# EAGLE design UltiMem64_v1 (EAGLE 7.7.0)

## Sheet 1 of 2
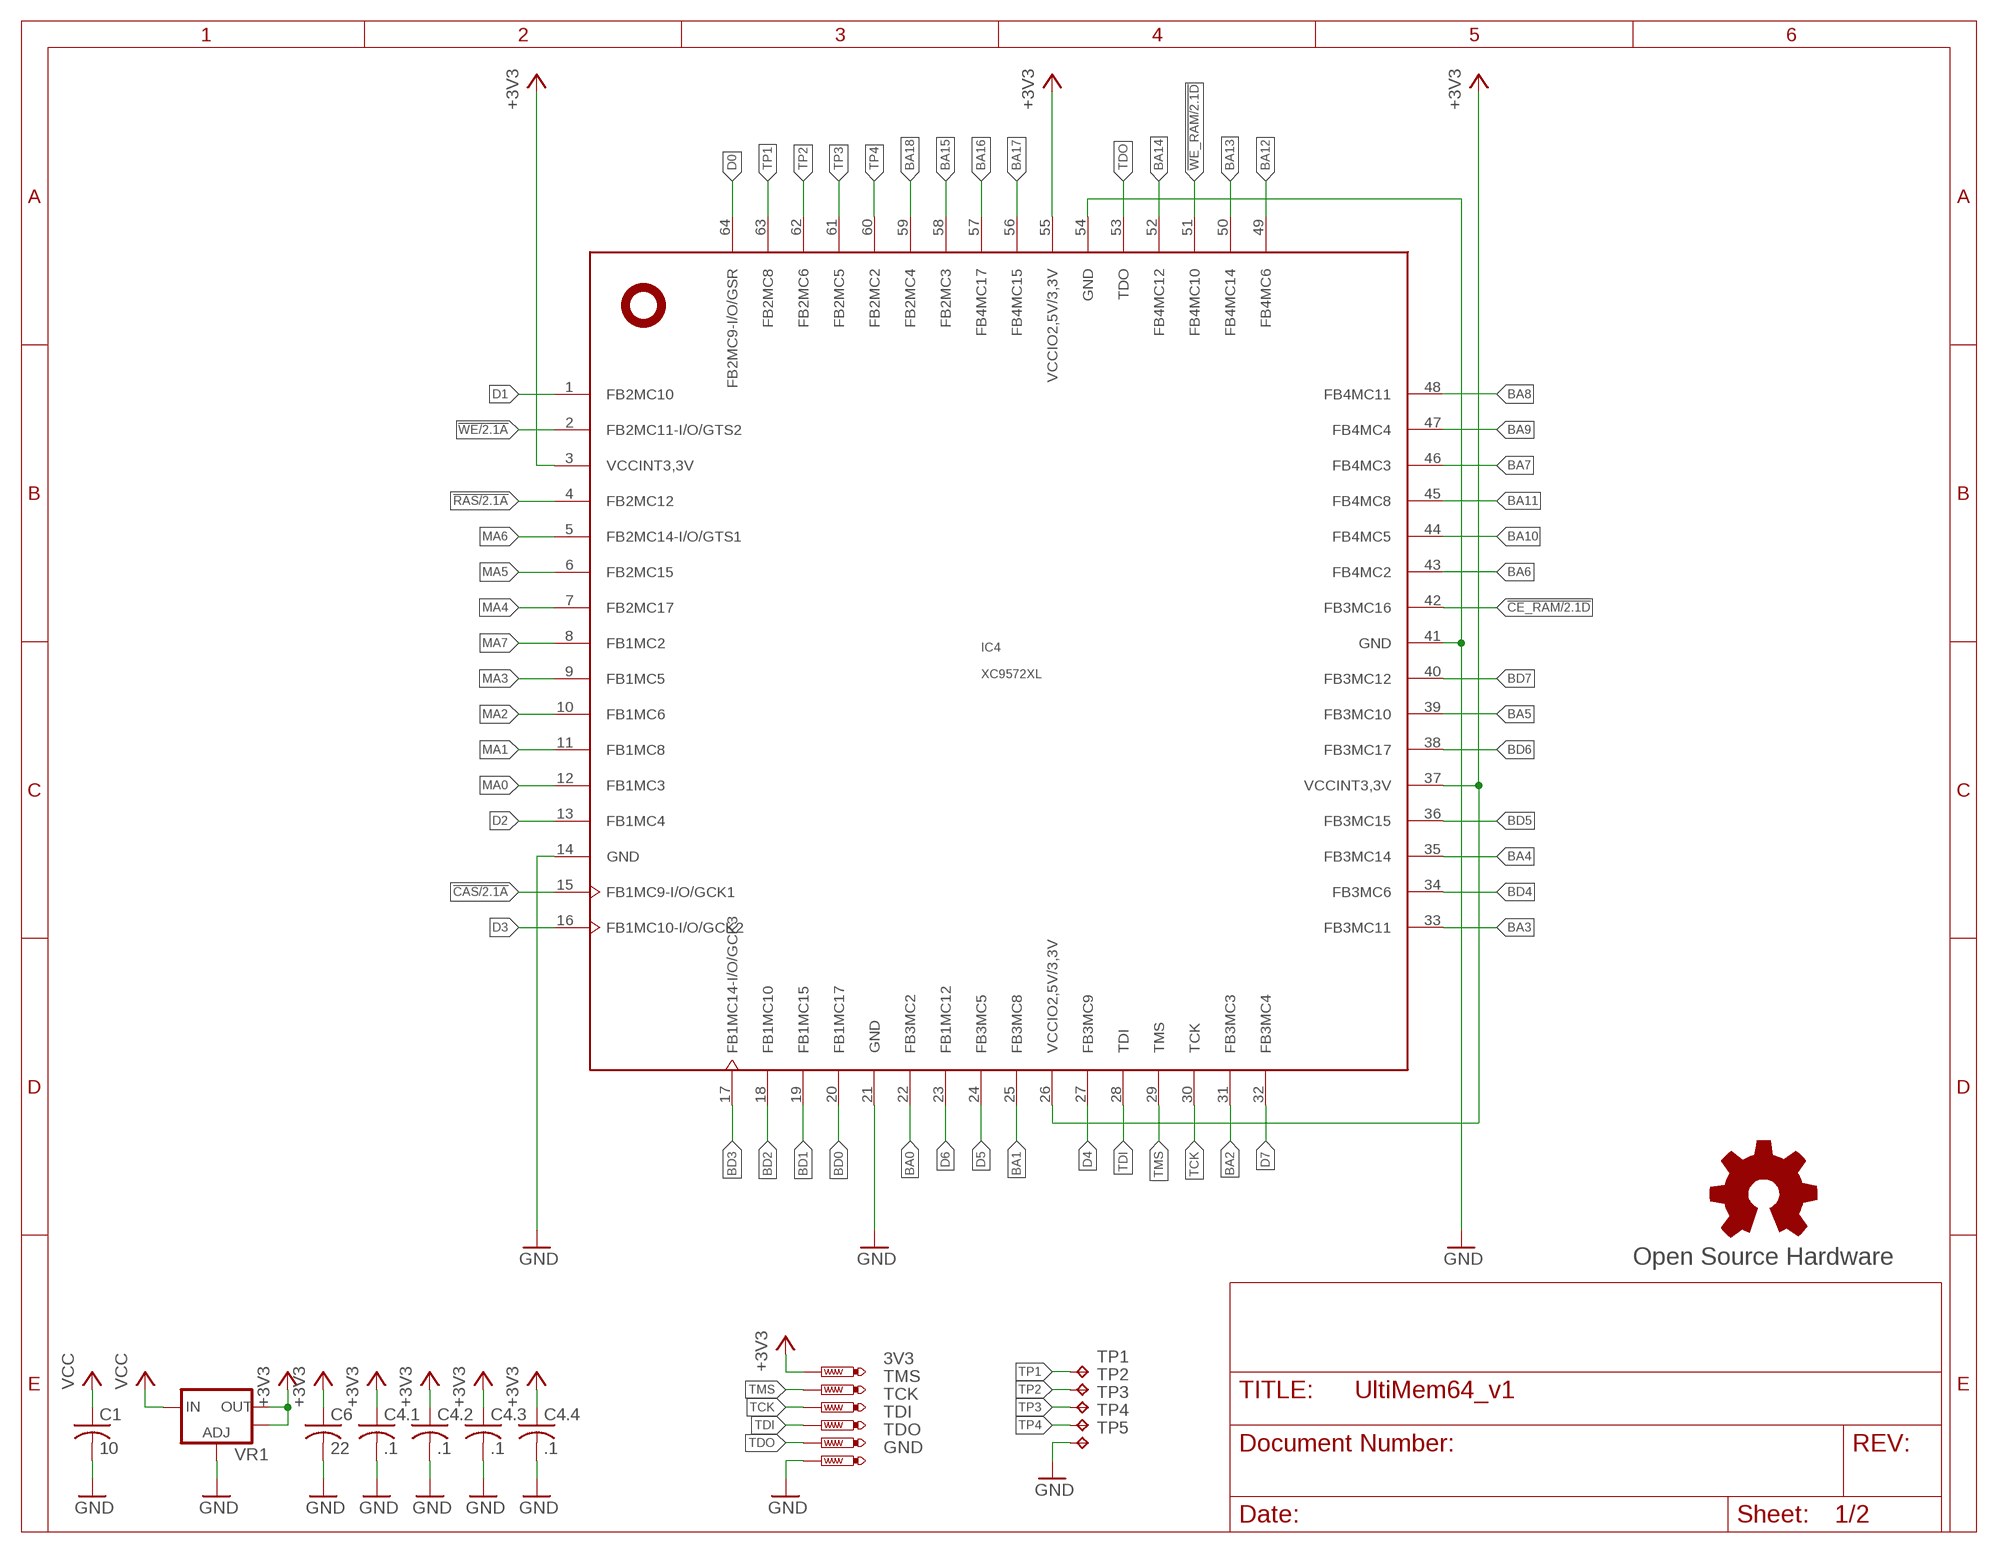
[diagram p0: schematic, sheet 1]

### Parts
3V3  PTR1TP08R  [TP08R]
C1  10  C-USC0805  [C0805]
C4.1  .1  C-USC0402  [C0402]
C4.2  .1  C-USC0402  [C0402]
C4.3  .1  C-USC0402  [C0402]
C4.4  .1  C-USC0402  [C0402]
C6  22  C-USC0805  [C0805]
GND  PTR1TP08R  [TP08R]
GOLD_ORB_SM1  Open Source Hardware  OSHWLOGOLOGO5MM  [OSHW_5MM]
IC4  XC9572XL  XC9572XLVQG64  [VQFP64]
TCK  PTR1TP08R  [TP08R]
TDI  PTR1TP08R  [TP08R]
TDO  PTR1TP08R  [TP08R]
TMS  PTR1TP08R  [TP08R]
TP1  TPPAD1-13  [P1-13]
TP2  TPPAD1-13  [P1-13]
TP3  TPPAD1-13  [P1-13]
TP4  TPPAD1-13  [P1-13]
TP5  TPPAD1-13  [P1-13]
VR1  V_REG_LM1117SOT223  [SOT223]

### Nets
!CAS: IC4.15(FB1MC9-I/O/GCK1) ; also sheet 2
!CE_RAM: IC4.42(FB3MC16) ; also sheet 2
!RAS: IC4.4(FB2MC12) ; also sheet 2
!WE: IC4.2(FB2MC11-I/O/GTS2) ; also sheet 2
!WE_RAM: IC4.51(FB4MC10) ; also sheet 2
+3V3: 3V3.TP C4.1.1 C4.2.1 C4.3.1 C4.4.1 C6.1 IC4.3(VCCINT3,3V) IC4.26(VCCIO2,5V/3,3V) IC4.37(VCCINT3,3V) IC4.55(VCCIO2,5V/3,3V) VR1.2(OUT) VR1.4(OUT)
BA0: IC4.22(FB3MC2) ; also sheet 2
BA1: IC4.25(FB3MC8) ; also sheet 2
BA2: IC4.31(FB3MC3) ; also sheet 2
BA3: IC4.33(FB3MC11) ; also sheet 2
BA4: IC4.35(FB3MC14) ; also sheet 2
BA5: IC4.39(FB3MC10) ; also sheet 2
BA6: IC4.43(FB4MC2) ; also sheet 2
BA7: IC4.46(FB4MC3) ; also sheet 2
BA8: IC4.48(FB4MC11) ; also sheet 2
BA9: IC4.47(FB4MC4) ; also sheet 2
BA10: IC4.44(FB4MC5) ; also sheet 2
BA11: IC4.45(FB4MC8) ; also sheet 2
BA12: IC4.49(FB4MC6) ; also sheet 2
BA13: IC4.50(FB4MC14) ; also sheet 2
BA14: IC4.52(FB4MC12) ; also sheet 2
BA15: IC4.58(FB2MC3) ; also sheet 2
BA16: IC4.57(FB4MC17) ; also sheet 2
BA17: IC4.56(FB4MC15) ; also sheet 2
BA18: IC4.59(FB2MC4) ; also sheet 2
BD0: IC4.20(FB1MC17) ; also sheet 2
BD1: IC4.19(FB1MC15) ; also sheet 2
BD2: IC4.18(FB1MC10) ; also sheet 2
BD3: IC4.17(FB1MC14-I/O/GCK3) ; also sheet 2
BD4: IC4.34(FB3MC6) ; also sheet 2
BD5: IC4.36(FB3MC15) ; also sheet 2
BD6: IC4.38(FB3MC17) ; also sheet 2
BD7: IC4.40(FB3MC12) ; also sheet 2
D0: IC4.64(FB2MC9-I/O/GSR) ; also sheet 2
D1: IC4.1(FB2MC10) ; also sheet 2
D2: IC4.13(FB1MC4) ; also sheet 2
D3: IC4.16(FB1MC10-I/O/GCK2) ; also sheet 2
D4: IC4.27(FB3MC9) ; also sheet 2
D5: IC4.24(FB3MC5) ; also sheet 2
D6: IC4.23(FB1MC12) ; also sheet 2
D7: IC4.32(FB3MC4) ; also sheet 2
GND: C1.2 C4.1.2 C4.2.2 C4.3.2 C4.4.2 C6.2 GND.TP IC4.14(GND) IC4.21(GND) IC4.41(GND) IC4.54(GND) TP5.TP VR1.1(ADJ) ; also sheet 2
MA0: IC4.12(FB1MC3) ; also sheet 2
MA1: IC4.11(FB1MC8) ; also sheet 2
MA2: IC4.10(FB1MC6) ; also sheet 2
MA3: IC4.9(FB1MC5) ; also sheet 2
MA4: IC4.7(FB2MC17) ; also sheet 2
MA5: IC4.6(FB2MC15) ; also sheet 2
MA6: IC4.5(FB2MC14-I/O/GTS1) ; also sheet 2
MA7: IC4.8(FB1MC2) ; also sheet 2
TCK: IC4.30(TCK) TCK.TP
TDI: IC4.28(TDI) TDI.TP
TDO: IC4.53(TDO) TDO.TP
TMS: IC4.29(TMS) TMS.TP
TP1: IC4.63(FB2MC8) TP1.TP
TP2: IC4.62(FB2MC6) TP2.TP
TP3: IC4.61(FB2MC5) TP3.TP
TP4: IC4.60(FB2MC2) TP4.TP
VCC: C1.1 VR1.3(IN) ; also sheet 2

## Sheet 2 of 2: MEMORY
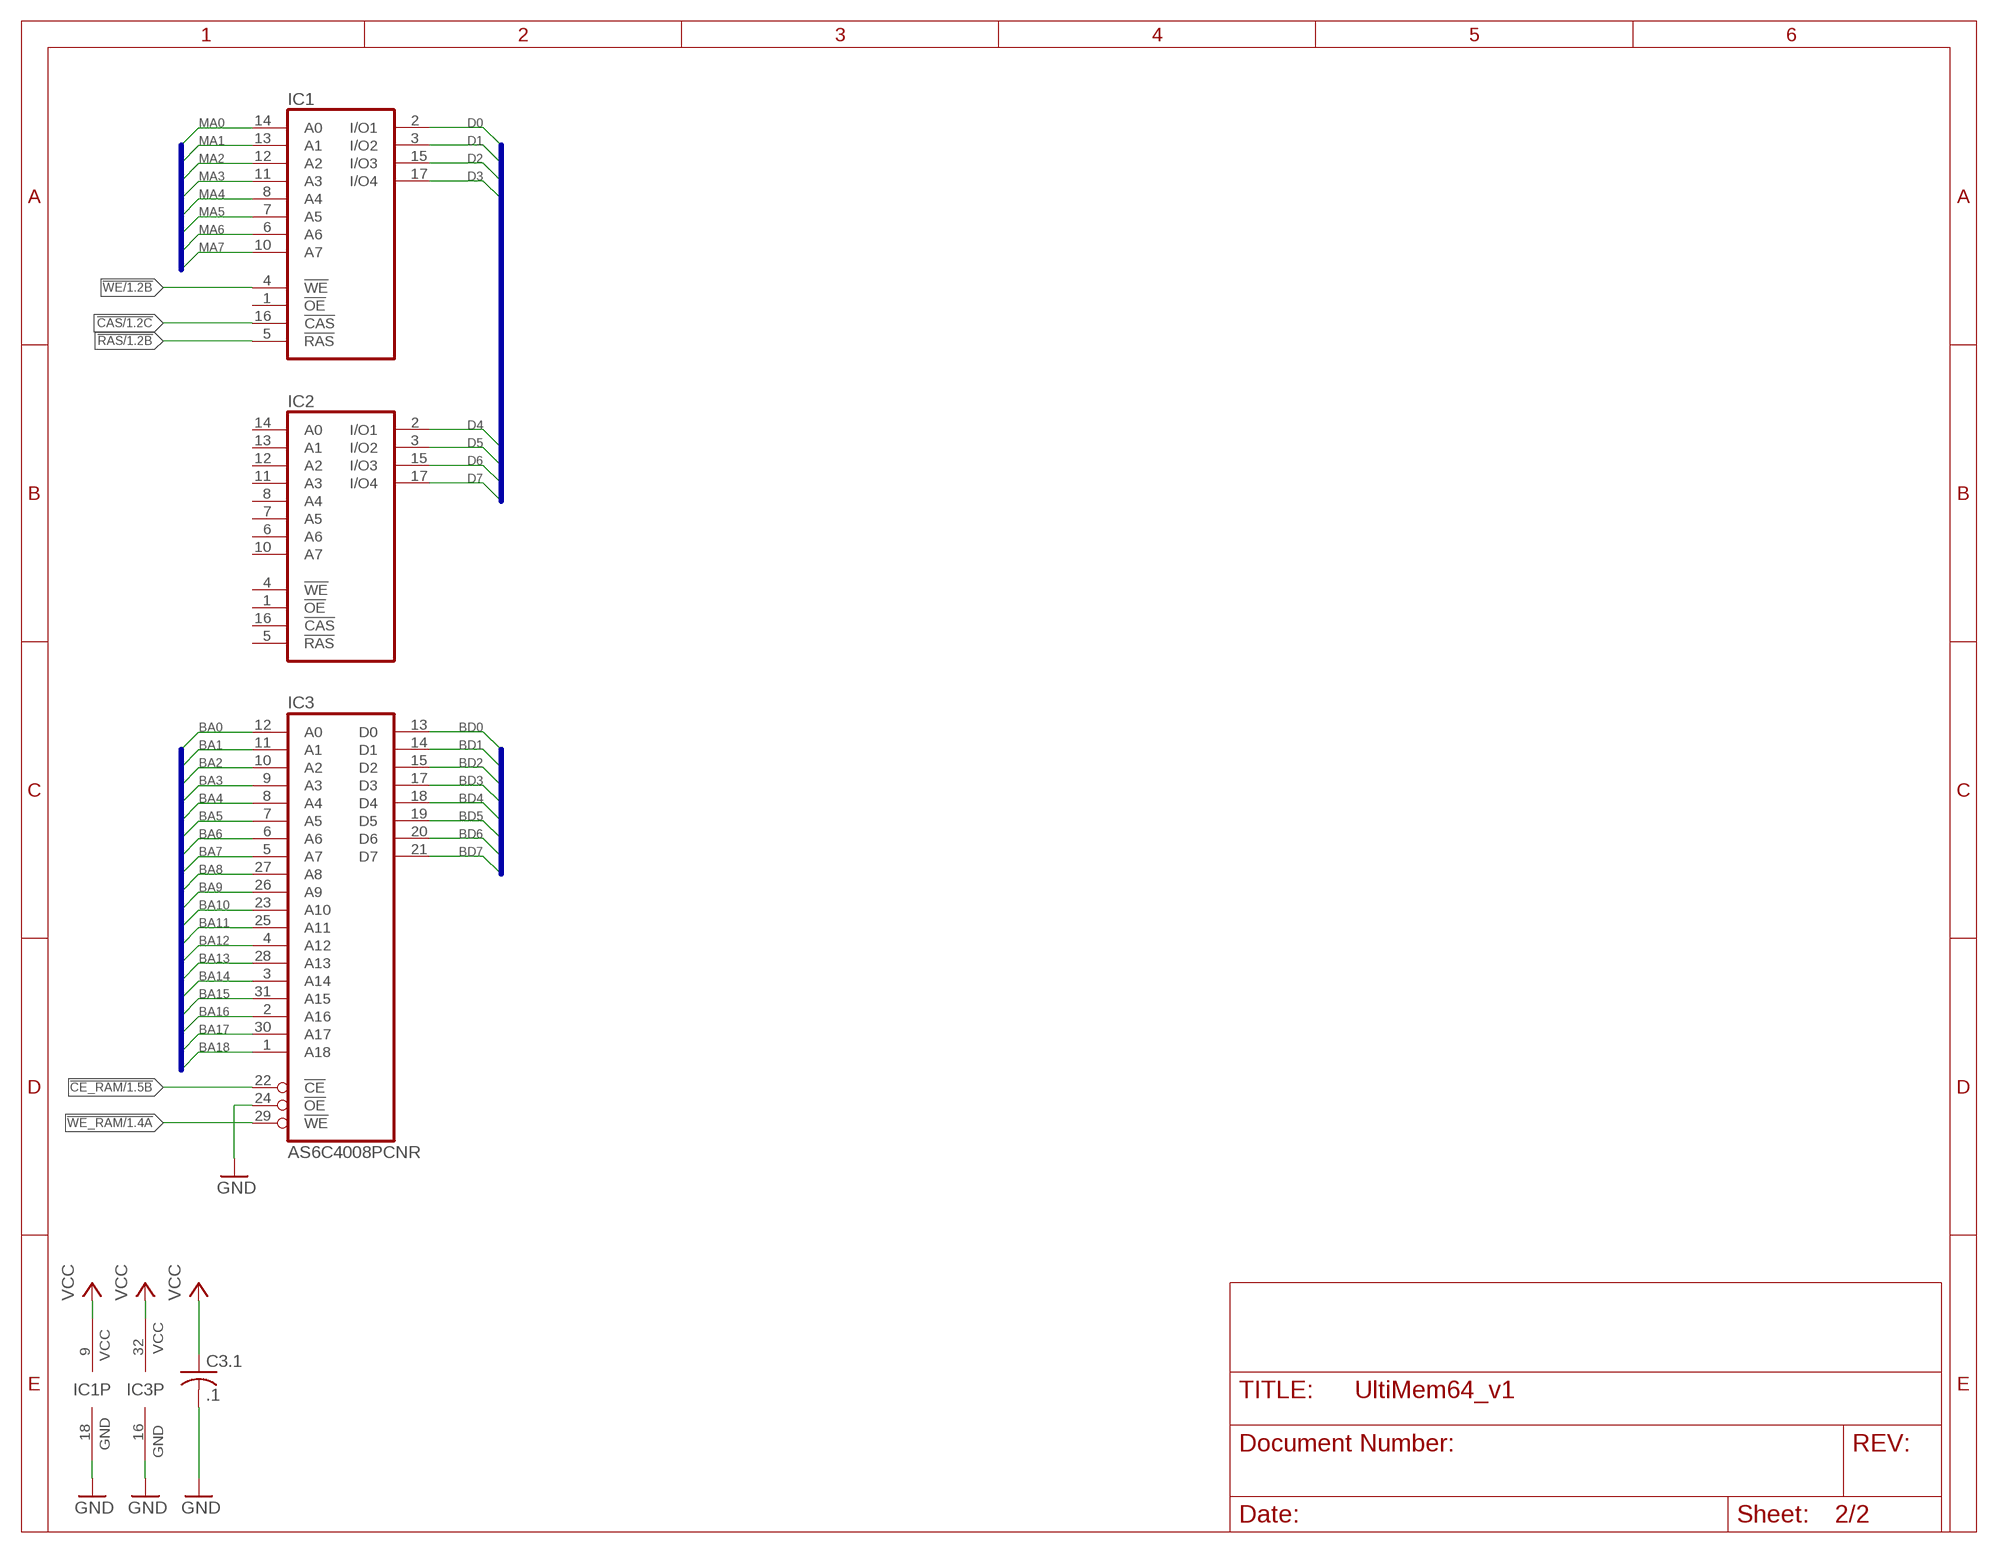
[diagram p1: schematic, sheet 2]

### Parts
C3.1  .1  C-USC0402  [C0402]
IC1  41464C-HDR  [DIL18_REV]
IC2  41464C-HDR  [DIL18_REV]
IC3  AS6C4008PCNR  [DIL32-RP]

### Nets
!CAS: IC1.16(!CAS) ; also sheet 1
!CE_RAM: IC3.22(!CE) ; also sheet 1
!RAS: IC1.5(!RAS) ; also sheet 1
!WE: IC1.4(!WE) ; also sheet 1
!WE_RAM: IC3.29(!WE) ; also sheet 1
BA0: IC3.12(A0) ; also sheet 1
BA1: IC3.11(A1) ; also sheet 1
BA2: IC3.10(A2) ; also sheet 1
BA3: IC3.9(A3) ; also sheet 1
BA4: IC3.8(A4) ; also sheet 1
BA5: IC3.7(A5) ; also sheet 1
BA6: IC3.6(A6) ; also sheet 1
BA7: IC3.5(A7) ; also sheet 1
BA8: IC3.27(A8) ; also sheet 1
BA9: IC3.26(A9) ; also sheet 1
BA10: IC3.23(A10) ; also sheet 1
BA11: IC3.25(A11) ; also sheet 1
BA12: IC3.4(A12) ; also sheet 1
BA13: IC3.28(A13) ; also sheet 1
BA14: IC3.3(A14) ; also sheet 1
BA15: IC3.31(A15) ; also sheet 1
BA16: IC3.2(A16) ; also sheet 1
BA17: IC3.30(A17) ; also sheet 1
BA18: IC3.1(A18) ; also sheet 1
BD0: IC3.13(D0) ; also sheet 1
BD1: IC3.14(D1) ; also sheet 1
BD2: IC3.15(D2) ; also sheet 1
BD3: IC3.17(D3) ; also sheet 1
BD4: IC3.18(D4) ; also sheet 1
BD5: IC3.19(D5) ; also sheet 1
BD6: IC3.20(D6) ; also sheet 1
BD7: IC3.21(D7) ; also sheet 1
D0: IC1.2(I/O1) ; also sheet 1
D1: IC1.3(I/O2) ; also sheet 1
D2: IC1.15(I/O3) ; also sheet 1
D3: IC1.17(I/O4) ; also sheet 1
D4: IC2.2(I/O1) ; also sheet 1
D5: IC2.3(I/O2) ; also sheet 1
D6: IC2.15(I/O3) ; also sheet 1
D7: IC2.17(I/O4) ; also sheet 1
GND: C3.1.2 IC1.18(GND) IC3.16(GND) IC3.24(!OE) ; also sheet 1
MA0: IC1.14(A0) ; also sheet 1
MA1: IC1.13(A1) ; also sheet 1
MA2: IC1.12(A2) ; also sheet 1
MA3: IC1.11(A3) ; also sheet 1
MA4: IC1.8(A4) ; also sheet 1
MA5: IC1.7(A5) ; also sheet 1
MA6: IC1.6(A6) ; also sheet 1
MA7: IC1.10(A7) ; also sheet 1
VCC: C3.1.1 IC1.9(VCC) IC3.32(VCC) ; also sheet 1
Unconnected: IC1.1(!OE) IC2.1(!OE) IC2.4(!WE) IC2.5(!RAS) IC2.6(A6) IC2.7(A5) IC2.8(A4) IC2.10(A7) IC2.11(A3) IC2.12(A2) IC2.13(A1) IC2.14(A0) IC2.16(!CAS)

### Buses
MA[0..7]
D[0..7]
BD[0..7]
BA[0..18]

## Power pins joined to a net without a drawn wire
GND: IC2.18(GND)
VCC: IC2.9(VCC)

## Library data of the parts
3V3 GND TCK TDI TDO TMS = testpad:PTR1: TEST PIN
C1 C3.1 C4.1-C4.4 C6 = rcl:C-US: CAPACITOR, American symbol
GOLD_ORB_SM1 = oshw:OSHWLOGO: The OSHW logo for PCB layout
IC1 IC2 = memory-jlb:41464C: MEMORY
IC3 = memory-alliance:AS6C4008
IC4 = xilinx_xc95XXXxl:XC9572XLVQG64
TP1-TP5 = testpad:TP: Test pad
VR1 = SparkFun:V_REG_LM1117: Voltage Regulator LM1117 Standard adjustable voltage regulator but in SMD form. Spark Fun Electronics SKU : COM-00595

## Board
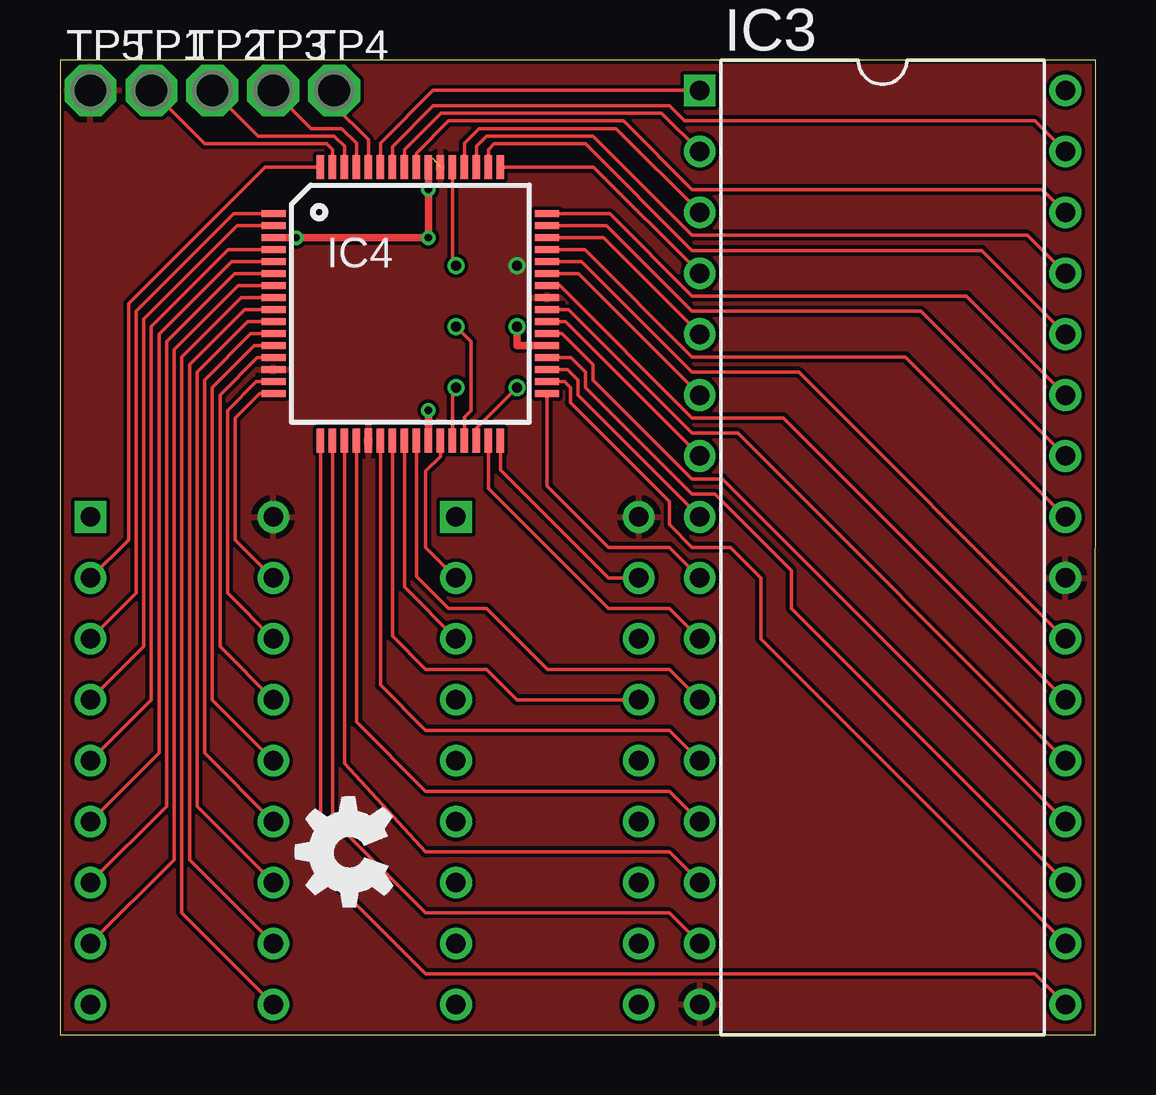
[diagram p2: board, top side]
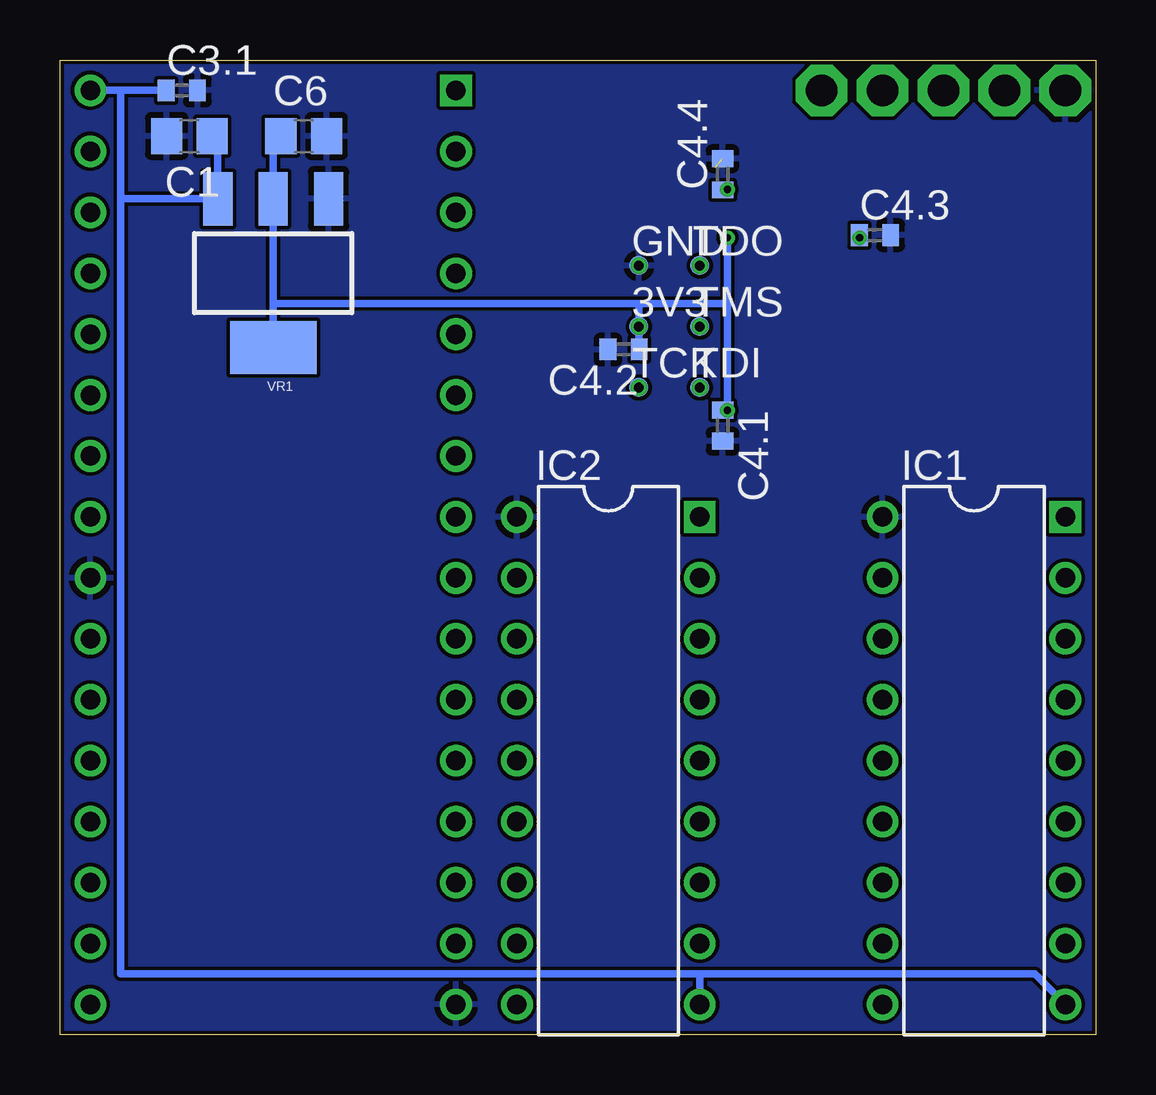
[diagram p3: board, bottom side, seen from below]

Size 43.18 x 40.64 mm. Coordinates in mm from the lower left corner, seen from the top.
Outline: 0,0 43.16,0 43.18,40.64 0,40.64 0,0
Copper layers (1*16): Top 0.035mm / dielectric 1.5mm / Bottom 0.035mm
Design rules "hackvana": minimum track width 6mil, minimum drill 0.3mm, track to track 6mil, track to pad 6mil, pad to pad 6mil, via to via 6mil, smd to smd 0mil, copper to edge 6mil, drill to drill 6mil, minimum pad ring 10mil, minimum via ring 6mil, stop-mask expansion 2mil, vias tented up to drill 100mil, thermal gap 10mil

### Footprints (pad centres in the part's own frame; a part is rotated, then mirrored left to right if it is on the bottom)
TP08R = smd 0.8 x 0.8: TP 0,0
C0805 = smd 1.3 x 1.5: 1 -0.95,0; 2 0.95,0
C0402 = smd 0.7 x 0.9: 1 -0.65,0; 2 0.65,0
DIL18_REV = drill 0.813 square: 1 -10.16,-3.81 | drill 0.813: 2 -7.62,-3.81; 3 -5.08,-3.81; 4 -2.54,-3.81; 5 0,-3.81; 6 2.54,-3.81; 7 5.08,-3.81; 8 7.62,-3.81; 9 10.16,-3.81; 10 10.16,3.81; 11 7.62,3.81; 12 5.08,3.81; 13 2.54,3.81; 14 0,3.81; 15 -2.54,3.81; 16 -5.08,3.81; 17 -7.62,3.81; 18 -10.16,3.81
DIL32-RP = drill 0.813 square: 1 -19.05,-7.62 | drill 0.813: 2 -16.51,-7.62; 3 -13.97,-7.62; 4 -11.43,-7.62; 5 -8.89,-7.62; 6 -6.35,-7.62; 7 -3.81,-7.62; 8 -1.27,-7.62; 9 1.27,-7.62; 10 3.81,-7.62; 11 6.35,-7.62; 12 8.89,-7.62; 13 11.43,-7.62; 14 13.97,-7.62; 15 16.51,-7.62; 16 19.05,-7.62; 17 19.05,7.62; 18 16.51,7.62; 19 13.97,7.62; 20 11.43,7.62; 21 8.89,7.62; 22 6.35,7.62; 23 3.81,7.62; 24 1.27,7.62; 25 -1.27,7.62; 26 -3.81,7.62; 27 -6.35,7.62; 28 -8.89,7.62; 29 -11.43,7.62; 30 -13.97,7.62; 31 -16.51,7.62; 32 -19.05,7.62
VQFP64 = smd 1 x 0.3: 1 -5.7,3.75; 2 -5.7,3.25; 3 -5.7,2.75; 4 -5.7,2.25; 5 -5.7,1.75; 6 -5.7,1.25; 7 -5.7,0.75; 8 -5.7,0.25; 9 -5.7,-0.25; 10 -5.7,-0.75; 11 -5.7,-1.25; 12 -5.7,-1.75; 13 -5.7,-2.25; 14 -5.7,-2.75; 15 -5.7,-3.25; 16 -5.7,-3.75; 33 5.7,-3.75; 34 5.7,-3.25; 35 5.7,-2.75; 36 5.7,-2.25; 37 5.7,-1.75; 38 5.7,-1.25; 39 5.7,-0.75; 40 5.7,-0.25; 41 5.7,0.25; 42 5.7,0.75; 43 5.7,1.25; 44 5.7,1.75; 45 5.7,2.25; 46 5.7,2.75; 47 5.7,3.25; 48 5.7,3.75 | smd 0.3 x 1: 17 -3.75,-5.7; 18 -3.25,-5.7; 19 -2.75,-5.7; 20 -2.25,-5.7; 21 -1.75,-5.7; 22 -1.25,-5.7; 23 -0.75,-5.7; 24 -0.25,-5.7; 25 0.25,-5.7; 26 0.75,-5.7; 27 1.25,-5.7; 28 1.75,-5.7; 29 2.25,-5.7; 30 2.75,-5.7; 31 3.25,-5.7; 32 3.75,-5.7; 49 3.75,5.7; 50 3.25,5.7; 51 2.75,5.7; 52 2.25,5.7; 53 1.75,5.7; 54 1.25,5.7; 55 0.75,5.7; 56 0.25,5.7; 57 -0.25,5.7; 58 -0.75,5.7; 59 -1.25,5.7; 60 -1.75,5.7; 61 -2.25,5.7; 62 -2.75,5.7; 63 -3.25,5.7; 64 -3.75,5.7
P1-13 = drill 1.321 pad 2.159 octagon: TP 0,0
SOT223 = smd 1.219 x 2.235: 1 -2.311,-3.099; 2 0,-3.099; 3 2.311,-3.099 | smd 3.6 x 2.2: 4 0,3.099

### Placement (x,y rotation side)
3V3  19.05,29.53 0 bottom
C1  37.78,37.47 180 bottom
C3.1  38.1,39.37 0 bottom
C4.1  15.56,25.4 270 bottom
C4.2  19.68,28.57 180 bottom
C4.3  9.21,33.34 0 bottom
C4.4  15.56,35.88 90 bottom
C6  33.02,37.47 0 bottom
GND  19.05,32.07 0 bottom
GOLD_ORB_SM1  12.06,7.62 90 top
IC1  5.08,11.43 270 top
IC2  20.32,11.43 270 top
IC3  34.29,20.32 270 top
IC4  14.61,30.48 0 top
TCK  19.05,26.99 0 bottom
TDI  16.51,26.99 0 bottom
TDO  16.51,32.07 0 bottom
TMS  16.51,29.53 0 bottom
TP1  3.81,39.37 0 top
TP2  6.35,39.37 0 top
TP3  8.89,39.37 0 top
TP4  11.43,39.37 0 top
TP5  1.27,39.37 0 top
VR1  34.29,31.75 180 bottom

### Tracks (layer width: path | path; a pad name or v marks a point on that pad's centre or on a via)
!CAS
  Top 0.152: IC1.16 6.99,18.41 6.99,26.04 8.18,27.23 IC4.15
!CE_RAM
  Top 0.152: IC3.22 30.16,25.72 26.35,25.72 20.84,31.23 IC4.42
!RAS
  Top 0.152: IC1.5 3.81,13.97 3.81,29.53 7.01,32.73 IC4.4
!WE
  Top 0.152: IC1.4 3.49,16.19 3.49,29.84 7.38,33.73 IC4.2
!WE_RAM
  Top 0.152: IC3.29 40.32,33.34 26.35,33.34 22.23,37.47 17.78,37.47 17.36,37.04 IC4.51
+3V3  (via drill 0.3, 0.41)
  Top 0.305: IC4.55 v15.36,35.24 v15.36,33.23 v9.84,33.23 IC4.3 | IC4.37 19.05,28.73 3V3.TP | v15.36,26.04 IC4.26
  Bottom 0.305: v15.36,33.23 15.36,30.48 | 15.36,30.48 v15.36,26.04 15.54,26.04 C4.1.1 | 34.29,30.48 VR1.2 34.29,37.47 C6.1 | 34.29,30.48 19.05,30.48 | 19.05,30.48 15.36,30.48 | VR1.4 34.29,30.48 | C4.4.1 15.36,35.23 v15.36,35.24 | C4.3.1 9.84,33.32 v9.84,33.23 | C4.2.1 19.05,28.59 3V3.TP 19.05,30.48
  other vias: 19.05,29.53
BA0
  Top 0.152: IC3.12 25.4,12.7 15.24,12.7 13.36,14.59 IC4.22
BA1
  Top 0.152: IC3.11 25.4,15.24 20.32,15.24 17.78,17.78 16.19,17.78 14.86,19.12 IC4.25
BA2
  Top 0.152: IC3.10 25.4,17.78 22.86,17.78 17.86,22.79 IC4.31
BA3
  Top 0.152: IC3.9 25.4,20.32 22.86,20.32 20.3,22.88 IC4.33
BA4
  Top 0.152: IC4.35 21.16,27.73 21.59,27.3 21.59,26.67 IC3.8
BA5
  Top 0.152: IC4.39 21.07,29.73 IC3.7
BA6
  Top 0.152: IC3.6 21.61,31.73 IC4.43
BA7
  Top 0.152: IC3.5 22.65,33.23 IC4.46
BA8
  Top 0.152: IC3.27 37.78,30.8 26.35,30.8 22.92,34.23 IC4.48
BA9
  Top 0.152: IC3.26 35.88,30.16 26.35,30.16 22.79,33.73 IC4.47
BA10
  Top 0.152: IC3.23 30.8,27.62 26.35,27.62 21.75,32.23 IC4.44
BA11
  Top 0.152: IC3.25 35.24,28.26 26.35,28.26 21.88,32.73 IC4.45
BA12
  Top 0.152: IC4.49 22.24,36.18 IC3.4
BA13
  Top 0.152: IC3.28 38.42,32.7 26.35,32.7 21.91,37.15 18.1,37.15 17.86,36.91 IC4.50
BA14
  Top 0.152: IC3.3 23.18,37.78 17.46,37.78 16.86,37.17 IC4.52
BA15
  Top 0.152: IC3.31 40.64,38.1 26.04,38.1 25.4,38.73 15.56,38.73 13.86,37.03 IC4.58
BA16
  Top 0.152: IC3.2 25.08,38.42 15.88,38.42 14.36,36.9 IC4.57
BA17
  Top 0.152: IC3.30 40.96,35.24 26.35,35.24 23.5,38.1 16.19,38.1 14.86,36.76 IC4.56
BA18
  Top 0.152: IC4.59 13.36,37.17 15.56,39.37 IC3.1
BD0
  Top 0.152: IC3.13 25.4,10.16 15.24,10.16 12.36,13.04 IC4.20
BD1
  Top 0.152: IC3.14 25.4,7.62 15.24,7.62 11.86,11.32 IC4.19
BD2
  Top 0.152: IC3.15 25.4,5.08 15.24,5.08 11.36,8.96 IC4.18
BD3
  Top 0.152: IC3.17 40.64,2.54 15.24,2.54 10.86,6.92 IC4.17
BD4
  Top 0.152: IC3.18 29.21,16.51 29.21,19.05 27.94,20.32 26.35,20.32 25.4,21.27 25.4,22.23 21.27,26.35 21.27,26.99 21.03,27.23 IC4.34
BD5
  Top 0.152: IC4.36 21.3,28.23 21.91,27.62 21.91,26.99 26.35,22.54 27.3,22.54 30.48,19.37 30.48,17.78 IC3.19
BD6
  Top 0.152: IC4.38 20.93,29.23 22.23,27.94 22.23,27.3 26.35,23.18 27.62,23.18 IC3.20
BD7
  Top 0.152: IC3.21 28.26,25.08 26.35,25.08 21.2,30.23 IC4.40
D0
  Top 0.152: IC1.2 2.86,20.64 2.86,30.48 8.56,36.18 IC4.64
D1
  Top 0.152: IC1.3 3.17,18.41 3.17,30.16 7.24,34.23 IC4.1
D2
  Top 0.152: IC1.15 6.67,16.19 6.67,26.67 8.23,28.23 IC4.13
D3
  Top 0.152: IC1.17 7.3,20.64 7.3,25.72 8.31,26.73 IC4.16
D4
  Top 0.152: IC2.2 15.24,20.32 15.24,23.5 15.86,24.11 IC4.27
D5
  Top 0.152: IC2.3 14.36,18.66 IC4.24
D6
  Top 0.152: IC2.15 19.05,13.97 17.78,15.24 15.24,15.24 13.86,16.62 IC4.23
D7
  Top 0.152: IC2.17 22.86,19.05 18.36,23.55 IC4.32
GND  (via drill 0.41)  (1 unrouted)
  other vias: 19.05,32.07
  pour Top: 0,40.64 0,0 43.18,0 43.18,40.64
  pour Bottom: 0,40.64 0,0 43.18,0 43.18,40.64
MA0
  Top 0.152: IC1.14 6.35,13.97 6.35,26.99 8.09,28.73 IC4.12
MA1
  Top 0.152: IC1.13 6.03,11.75 6.03,27.3 7.96,29.23 IC4.11
MA2
  Top 0.152: IC1.12 5.71,9.53 5.71,27.62 7.82,29.73 IC4.10
MA3
  Top 0.152: IC1.11 5.4,7.3 5.4,27.94 7.69,30.23 IC4.9
MA4
  Top 0.152: IC1.8 4.76,7.3 4.76,28.57 7.42,31.23 IC4.7
MA5
  Top 0.152: IC1.7 4.45,9.53 4.45,28.89 7.28,31.73 IC4.6
MA6
  Top 0.152: IC1.6 4.13,11.75 4.13,29.21 7.15,32.23 IC4.5
MA7
  Top 0.152: IC1.10 5.08,5.08 5.08,28.26 7.55,30.73 IC4.8
TCK  (via drill 0.41)
  Top 0.152: IC4.30 17.36,25.29 TCK.TP
  other vias: 19.05,26.99
TDI  (via drill 0.41)
  Top 0.152: IC4.28 16.36,26.83 TDI.TP
  other vias: 16.51,26.99
TDO  (via drill 0.41)
  Top 0.152: IC4.53 16.36,32.22 TDO.TP
  other vias: 16.51,32.07
TMS  (via drill 0.41)
  Top 0.152: IC4.29 16.86,25.75 17.14,26.04 17.14,28.89 TMS.TP
  other vias: 16.51,29.53
TP1
  Top 0.152: IC4.63 11.36,36.91 11.11,37.15 6.03,37.15 TP1.TP
TP2
  Top 0.152: IC4.62 11.86,37.04 11.43,37.47 8.26,37.47 TP2.TP
TP3
  Top 0.152: IC4.61 12.36,37.17 11.75,37.78 10.48,37.78 TP3.TP
TP4
  Top 0.152: IC4.60 12.86,37.31 11.43,38.73 TP4.TP
VCC
  Bottom 0.305: IC1.9 2.54,2.54 16.51,2.54 | 16.51,2.54 IC2.9 | 40.64,39.37 40.64,34.85 | 40.64,34.85 40.64,2.54 16.51,2.54 | 40.64,34.85 VR1.3 36.6,37.47 C1.1 | C3.1.1 40.64,39.37 | 40.64,39.37 IC3.32